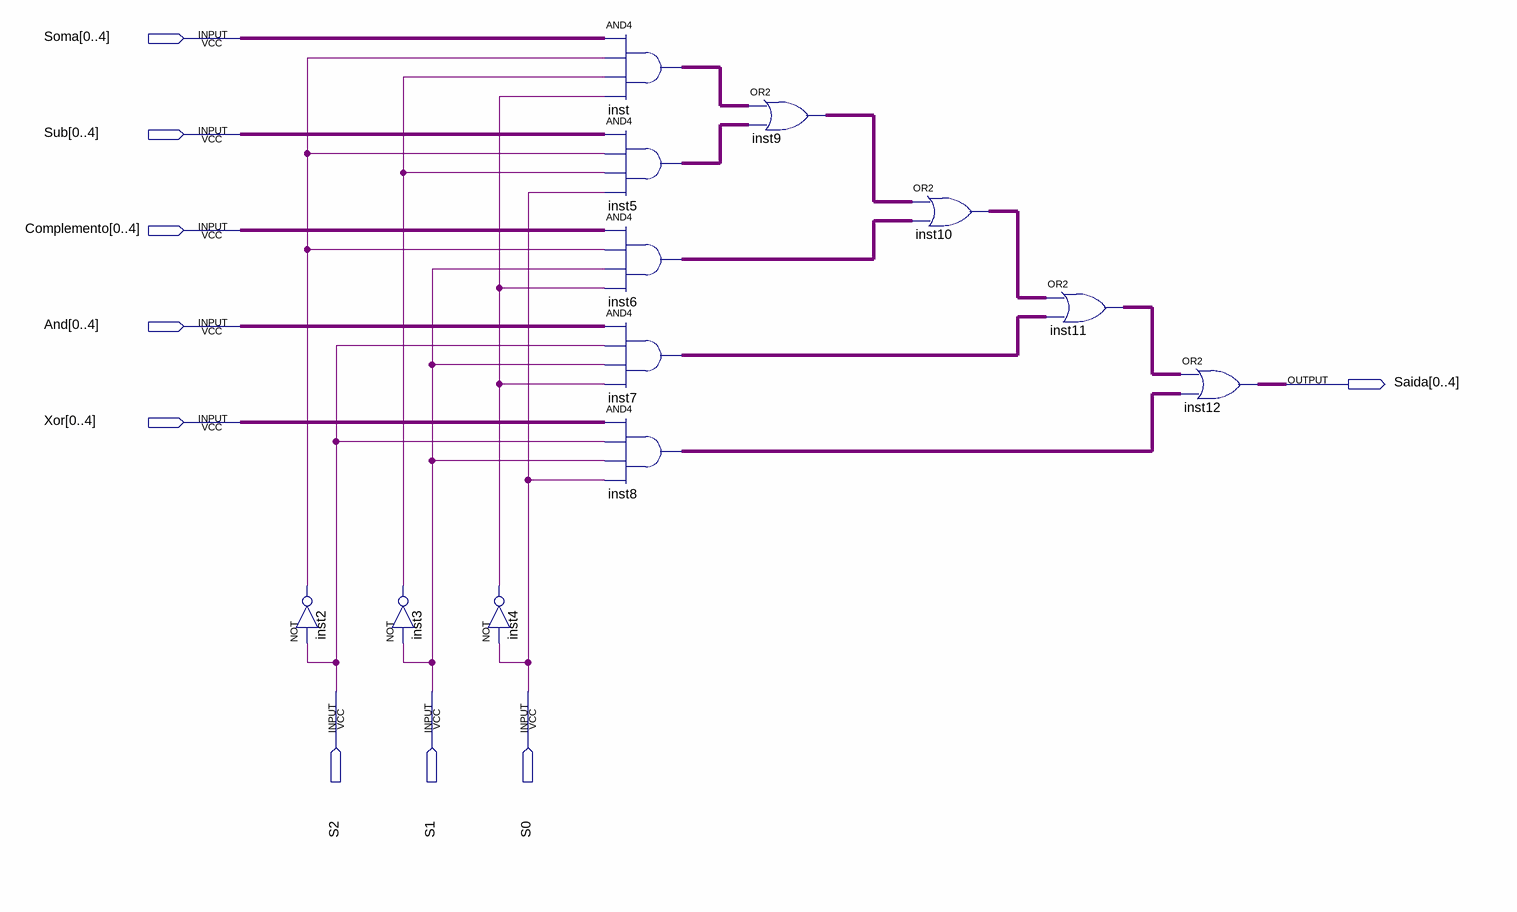
[diagram p0: schematic sheet]
// Quartus schematic mux_5bits.bdf as structural Verilog: 12 symbols, 9 pins
module mux_5bits (
  input  [0:4] Soma,
  input  [0:4] Sub,
  input  [0:4] Complemento,
  input  [0:4] And,
  input  [0:4] Xor,
  input  S2,
  input  S1,
  input  S0,
  output [0:4] Saida
);

  wire inst2_out, inst3_out, inst4_out;
  wire [4:0] inst5_out, inst6_out, inst7_out, inst8_out, inst9_out, inst10_out, inst11_out, inst_out;

  not inst2 (inst2_out, S2);
  not inst3 (inst3_out, S1);
  not inst4 (inst4_out, S0);
  assign inst_out = Soma & {5{inst2_out}} & {5{inst3_out}} & {5{inst4_out}};  // AND4 inst, 5 bits wide
  assign inst5_out = Sub & {5{inst2_out}} & {5{inst3_out}} & {5{S0}};  // AND4 inst5, 5 bits wide
  assign inst6_out = Complemento & {5{inst2_out}} & {5{S1}} & {5{inst4_out}};  // AND4 inst6, 5 bits wide
  assign inst7_out = And & {5{S2}} & {5{S1}} & {5{inst4_out}};  // AND4 inst7, 5 bits wide
  assign inst8_out = Xor & {5{S2}} & {5{S1}} & {5{S0}};  // AND4 inst8, 5 bits wide
  assign inst9_out = inst_out | inst5_out;  // OR2 inst9, 5 bits wide
  assign inst10_out = inst9_out | inst6_out;  // OR2 inst10, 5 bits wide
  assign inst11_out = inst10_out | inst7_out;  // OR2 inst11, 5 bits wide
  assign Saida = inst11_out | inst8_out;  // OR2 inst12, 5 bits wide
endmodule
